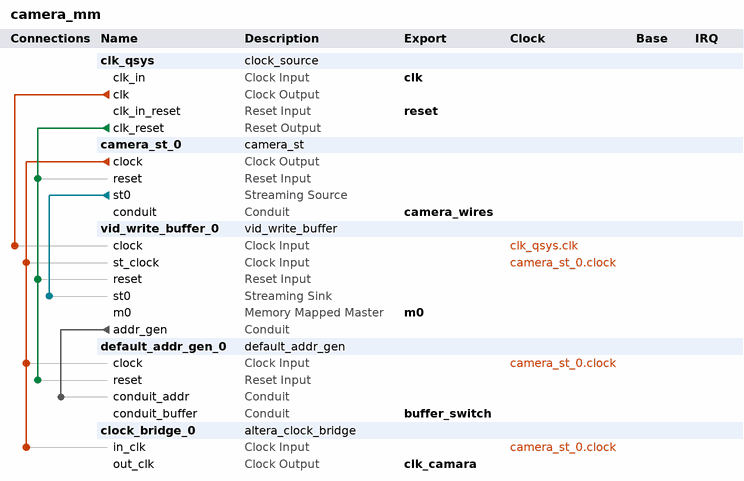
[diagram p0: system contents]
# Platform Designer (Qsys) system camera_mm, Cyclone IV GX EP4CGX150DF31C7
# Parameters at their usual value, and those the tool derives, are not listed.
package require -exact qsys 15.0
create_system camera_mm
set_project_property DEVICE_FAMILY {Cyclone IV GX}
set_project_property DEVICE EP4CGX150DF31C7

add_instance clk_qsys clock_source 15.0
set_instance_parameter_value clk_qsys clockFrequency 50000000

add_instance camera_st_0 camera_st 1.0
set_instance_parameter_value camera_st_0 DATA_WIDTH 32

add_instance vid_write_buffer_0 vid_write_buffer 2.0
set_instance_parameter_value vid_write_buffer_0 ADDR_WIDTH 27
set_instance_parameter_value vid_write_buffer_0 DATA_WIDTH 32
set_instance_parameter_value vid_write_buffer_0 FIFO_LENGTH_LOG_2 7

add_instance default_addr_gen_0 default_addr_gen 1.0
set_instance_parameter_value default_addr_gen_0 ADDR_WIDTH 27
set_instance_parameter_value default_addr_gen_0 BANK 0
set_instance_parameter_value default_addr_gen_0 HEIGHT 480
set_instance_parameter_value default_addr_gen_0 WIDTH 640

add_instance clock_bridge_0 altera_clock_bridge 15.0
set_instance_parameter_value clock_bridge_0 DERIVED_CLOCK_RATE 0
set_instance_parameter_value clock_bridge_0 EXPLICIT_CLOCK_RATE 0

# connections
add_connection camera_st_0.clock clock_bridge_0.in_clk clock
add_connection camera_st_0.clock default_addr_gen_0.clock clock
add_connection camera_st_0.clock vid_write_buffer_0.st_clock clock
add_connection clk_qsys.clk vid_write_buffer_0.clock clock
add_connection clk_qsys.clk_reset camera_st_0.reset reset
add_connection clk_qsys.clk_reset default_addr_gen_0.reset reset
add_connection clk_qsys.clk_reset vid_write_buffer_0.reset reset
add_connection camera_st_0.st0 vid_write_buffer_0.st0 avalon_streaming
add_connection vid_write_buffer_0.addr_gen default_addr_gen_0.conduit_addr conduit

# exported interfaces
add_interface buffer_switch conduit end
set_interface_property buffer_switch EXPORT_OF default_addr_gen_0.conduit_buffer
add_interface camera_wires conduit end
set_interface_property camera_wires EXPORT_OF camera_st_0.conduit
add_interface clk clock sink
set_interface_property clk EXPORT_OF clk_qsys.clk_in
add_interface clk_camara clock source
set_interface_property clk_camara EXPORT_OF clock_bridge_0.out_clk
add_interface m0 avalon master
set_interface_property m0 EXPORT_OF vid_write_buffer_0.m0
add_interface reset reset sink
set_interface_property reset EXPORT_OF clk_qsys.clk_in_reset

set_interconnect_requirement {$system} qsys_mm.clockCrossingAdapter HANDSHAKE
set_interconnect_requirement {$system} qsys_mm.enableEccProtection FALSE
set_interconnect_requirement {$system} qsys_mm.insertDefaultSlave FALSE
set_interconnect_requirement {$system} qsys_mm.maxAdditionalLatency 1

save_system camera_mm.qsys
